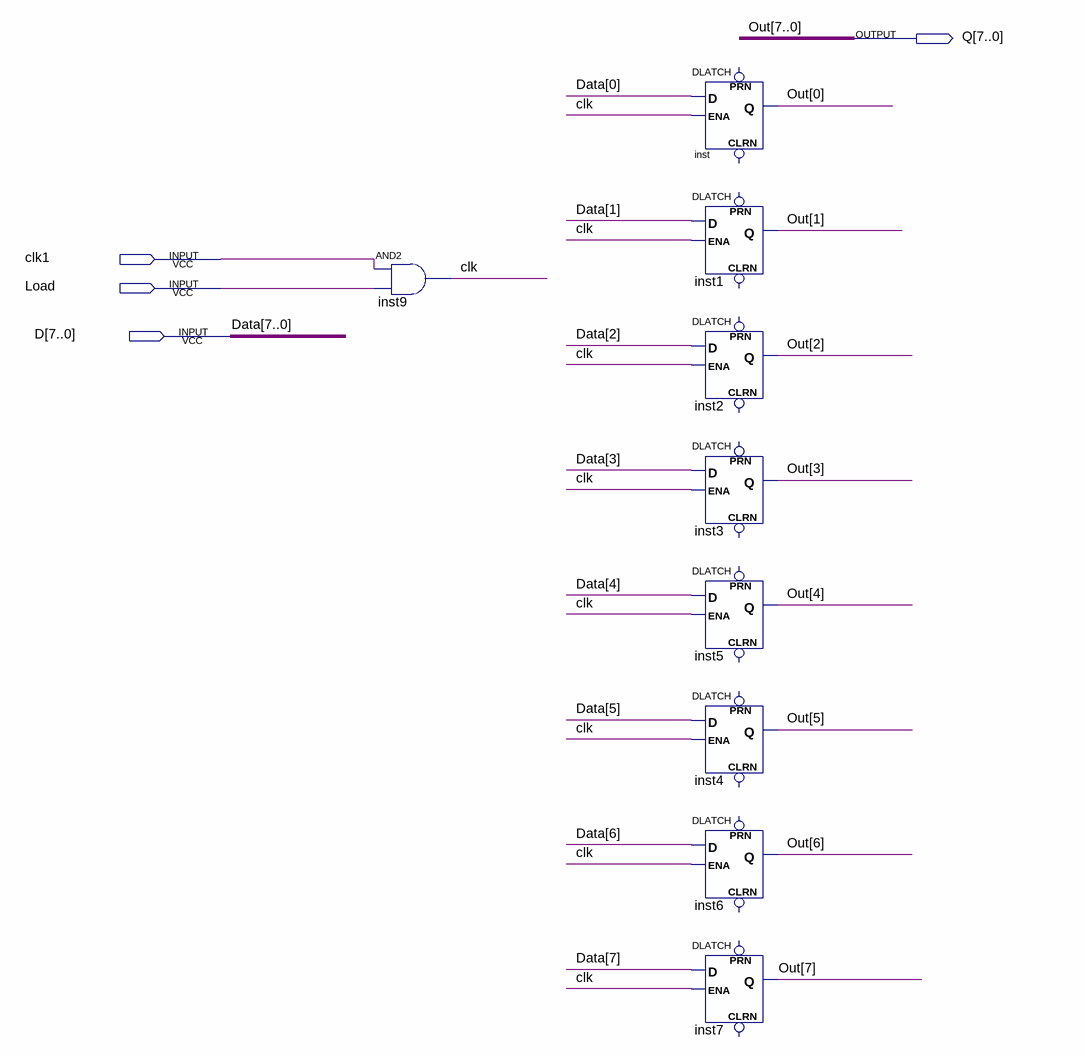
[diagram p0: schematic sheet]
// Quartus schematic latchbyte.bdf as structural Verilog: 9 symbols, 4 pins
module latchbyte (
  input  clk1,
  input  Load,
  input  [7:0] D,
  output [7:0] Q
);

  wire clk;

  and inst9 (clk, clk1, Load);
  DLATCH inst (.D(D[0]), .ENA(clk), .Q(Q[0]));  // open: CLRN, PRN
  DLATCH inst1 (.D(D[1]), .ENA(clk), .Q(Q[1]));  // open: CLRN, PRN
  DLATCH inst2 (.D(D[2]), .ENA(clk), .Q(Q[2]));  // open: CLRN, PRN
  DLATCH inst3 (.D(D[3]), .ENA(clk), .Q(Q[3]));  // open: CLRN, PRN
  DLATCH inst5 (.D(D[4]), .ENA(clk), .Q(Q[4]));  // open: CLRN, PRN
  DLATCH inst4 (.D(D[5]), .ENA(clk), .Q(Q[5]));  // open: CLRN, PRN
  DLATCH inst6 (.D(D[6]), .ENA(clk), .Q(Q[6]));  // open: CLRN, PRN
  DLATCH inst7 (.D(D[7]), .ENA(clk), .Q(Q[7]));  // open: CLRN, PRN

  // Other names for the same wires on the sheet: Data[7:0] = D; Out[7:0] = Q
endmodule
